# EAGLE schematic radio_V12.08.23 (EAGLE 5.01)
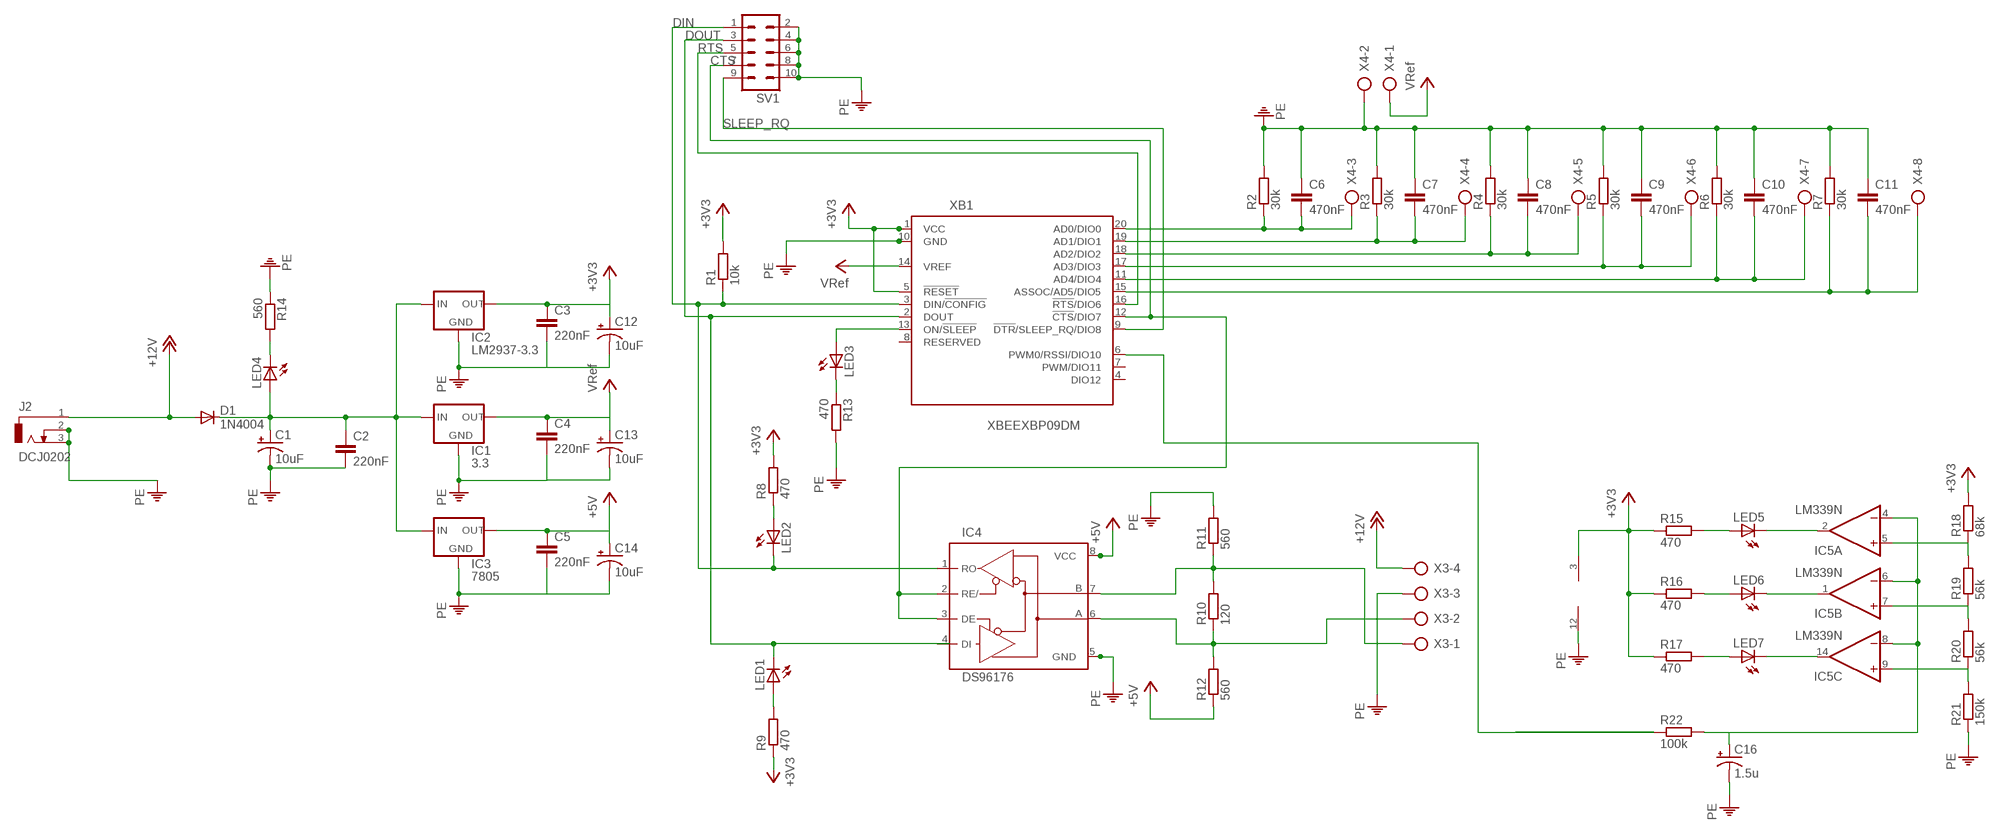
[diagram p0: schematic, sheet 1]

## Parts
C1  10uF  CPOL-USE2-5  [E2-5]
C2  220nF  C5/3.5  [C5B3.5]
C3  220nF  C5/3.5  [C5B3.5]
C4  220nF  C5/3.5  [C5B3.5]
C5  220nF  C5/3.5  [C5B3.5]
C6  470nF  C5/3.5  [C5B3.5]
C7  470nF  C5/3.5  [C5B3.5]
C8  470nF  C5/3.5  [C5B3.5]
C9  470nF  C5/3.5  [C5B3.5]
C10  470nF  C5/3.5  [C5B3.5]
C11  470nF  C5/3.5  [C5B3.5]
C12  10uF  CPOL-USE2-5  [E2-5]
C13  10uF  CPOL-USE2-5  [E2-5]
C14  10uF  CPOL-USE2-5  [E2-5]
C16  1.5u  CPOL-USE2-5  [E2-5]
D1  1N4004  [DO41-10]
IC1  3.3  78XXL  [78XXL]
IC2  LM2937-3.3  78XXL  [78XXL]
IC3  7805  78XXL  [78XXL]
IC4  DS96176  MAX3468CPA  [DIL08]
IC5  LM339N  [DIL14]
J2  DCJ0202  [DCJ0202]
LED1  LED3MM  [LED3MM]
LED2  LED3MM  [LED3MM]
LED3  LED3MM  [LED3MM]
LED4  LED5MM  [LED5MM]
LED5  LED3MM  [LED3MM]
LED6  LED3MM  [LED3MM]
LED7  LED3MM  [LED3MM]
R1  10k  R-EU_0207/7  [0207/7]
R2  30k  R-EU_0207/7  [0207/7]
R3  30k  R-EU_0207/7  [0207/7]
R4  30k  R-EU_0207/7  [0207/7]
R5  30k  R-EU_0207/7  [0207/7]
R6  30k  R-EU_0207/7  [0207/7]
R7  30k  R-EU_0207/7  [0207/7]
R8  470  R-EU_0207/7  [0207/7]
R9  470  R-EU_0207/7  [0207/7]
R10  120  R-EU_0207/7  [0207/7]
R11  560  R-EU_0207/7  [0207/7]
R12  560  R-EU_0207/7  [0207/7]
R13  470  R-EU_0207/7  [0207/7]
R14  560  R-EU_0207/7  [0207/7]
R15  470  R-EU_0207/7  [0207/7]
R16  470  R-EU_0207/7  [0207/7]
R17  470  R-EU_0207/7  [0207/7]
R18  68k  R-EU_0207/7  [0207/7]
R19  56k  R-EU_0207/7  [0207/7]
R20  56k  R-EU_0207/7  [0207/7]
R21  150k  R-EU_0207/7  [0207/7]
R22  100k  R-EU_0207/7  [0207/7]
SV1  ML10  [ML10]
X3  AK500/4-H  [AK500/4-H]
X4  AK500/8-H  [AK500/8-H]
XB1  XBEEXBP09DM  [XBEE-PRO]

## Nets
+3V3: C3.1 C12.+ IC2.OUT IC5.3(P:V+) R1.2 R8.2 R9.1 R15.1 R16.1 R17.1 R18.2 XB1.1(VCC) XB1.5(!RESET)
+5V: C5.1 C14.+ IC3.OUT IC4.8(VCC) R12.1
+12V: D1.A J2.1 X3.4
CTS: IC4.2(RE/) IC4.3(DE) SV1.7 XB1.12(!CTS!/DIO7)
DIN: IC4.1(RO) LED2.K(C) R1.1 SV1.1 XB1.3(DIN/!CONFIG)
DOUT: LED1.K(C) SV1.3 XB1.2(DOUT)
N$2: C1.+ C2.1 D1.C IC1.IN IC2.IN IC3.IN LED4.A
N$3: C6.2 R2.1 X4.3 XB1.20(AD0/DIO0)
N$4: C7.2 R3.1 X4.4 XB1.19(AD1/DIO1)
N$5: C8.2 R4.1 X4.5 XB1.18(AD2/DIO2)
N$6: C9.2 R5.1 X4.6 XB1.17(AD3/DIO3)
N$7: C10.2 R6.1 X4.7 XB1.11(AD4/DIO4)
N$8: C11.2 R7.1 X4.8 XB1.15(ASSOC/AD5/DIO5)
N$10: LED2.A R8.1
N$11: LED1.A R9.2
N$13: LED3.A XB1.13(ON/!SLEEP)
N$14: LED3.K(C) R13.1
N$15: LED4.K(C) R14.2
N$16: IC4.6(A) R10.1 R12.2 X3.2
N$17: IC4.7(B) R10.2 R11.1 X3.1
N$24: IC5.2(A:OUT) LED5.K(C)
N$25: IC5.1(B:OUT) LED6.K(C)
N$26: IC5.14(C:OUT) LED7.K(C)
N$27: LED7.A R17.2
N$28: LED6.A R16.2
N$29: LED5.A R15.2
N$30: IC5.5(A:+IN) R18.1 R19.2
N$31: IC5.7(B:+IN) R19.1 R20.2
N$32: IC5.9(C:+IN) R20.1 R21.2
N$33: C16.+ IC5.4(A:-IN) IC5.6(B:-IN) IC5.8(C:-IN) R22.2
N$36: R22.1 XB1.6(PWM0/RSSI/DIO10)
PE: C1.- C2.2 C3.2 C4.2 C5.2 C6.1 C7.1 C8.1 C9.1 C10.1 C11.1 C12.- C13.- C14.- C16.- IC1.GND IC2.GND IC3.GND IC4.5(GND) IC5.12(P:GND) J2.2 J2.3 R2.2 R3.2 R4.2 R5.2 R6.2 R7.2 R11.2 R13.2 R14.1 R21.1 SV1.2 SV1.4 SV1.6 SV1.8 SV1.10 X3.3 X4.2 XB1.10(GND)
RTS: SV1.5 XB1.16(!RTS!/DIO6)
SLEEP_RQ: SV1.9 XB1.9(!DTR!/SLEEP_RQ/DIO8)
VCC: C4.1 C13.+ IC1.OUT X4.1 XB1.14(VREF) ; supply symbol labelled VRef
Unconnected: IC4.4(DI) IC5.10(D:-IN) IC5.11(D:+IN) IC5.13(D:OUT) XB1.7(PWM/DIO11)

## Power pins joined to a net without a drawn wire
DIO12: XB1.4(DIO12)
RESERVED: XB1.8(RESERVED)

## Library data of the parts
C1 C12-C14 C16 = rcl:CPOL-US: POLARIZED CAPACITOR, American symbol
C2-C11 = capacitor-wima:C: CAPACITOR naming: grid - package width
D1 = diode:1N4004: DIODE general purpose rectifier, 1 A
IC1-IC3 = v-reg:78XXL: VOLTAGE REGULATOR
IC4 = maxim:MAX34*: +5V, Fail-Safe, 40Mbps, Profibus RS-485/RS-422 Transceivers Source: MAX3465-MAX3469.pdf
IC5 = linear:LM339: Low Power Low Offset Voltage Quad Comparators with open collector; LM139/LM239/LM339/LM2901/LM3302
J2 = con-jack:DCJ0202: DC POWER JACK Source: DCJ0202.pdf
LED1-LED7 = led:LED: LED OSRAM: - CHIPLED LG R971, LG N971, LY N971, LG Q971, LY Q971, LO R971, LY R971 LH N974, LH R974 LS Q976, LO Q976, LY Q976 LO Q996 - Hyper CHIPLED LW Q18S LB Q993, LB Q99A, LB R99A - SideLED LS A670, LO A670, LY A670, LG A670, LP A670 LB A673, LV A673, LT A673, LW A673 LH A674 LY A675 LS A676, LA A676, LO A676, LY A676, LW A676 LS A679, LY A679, LG A679 - Hyper Micro SIDELED® LS Y876, LA Y876, LO Y876, LY Y876 LT Y87S - SmartLED LW L88C, LW L88S LB L89C, LB L89S, LG L890 LS L89K, LO L89K, LY L89K LS L896, LA L896, LO L896, LY L896 - TOPLED LS T670, LO T670, LY T670, LG T670, LP T670 LSG T670, LSP T670, LSY T670, LOP T670, LYG T670 LG T671, LOG T671, LSG T671 LB T673, LV T673, LT T673, LW T673 LH T674 LS T676, LA T676, LO T676, LY T676, LB T676, LH T676, LSB T676, LW T676 LB T67C, LV T67C, LT T67C, LS T67K, LO T67K, LY T67K, LW E67C LS E67B, LA E67B, LO E67B, LY E67B, LB E67C, LV E67C, LT E67C LW T67C LS T679, LY T679, LG T679 LS T770, LO T770, LY T770, LG T770, LP T770 LB T773, LV T773, LT T773, LW T773 LH T774 LS E675, LA E675, LY E675, LS T675 LS T776, LA T776, LO T776, LY T776, LB T776 LHGB T686 LT T68C, LB T68C - Hyper Mini TOPLED® LB M676 - Mini TOPLED Santana® LG M470 LS M47K, LO M47K, LY M47K Source: http://www.osram.convergy.de - LUMILED® LXK2-PW12-R00, LXK2-PW12-S00, LXK2-PW14-U00, LXK2-PW14-V00 LXK2-PM12-R00, LXK2-PM12-S00, LXK2-PM14-U00 LXK2-PE12-Q00, LXK2-PE12-R00, LXK2-PE12-S00, LXK2-PE14-T00, LXK2-PE14-U00 LXK2-PB12-K00, LXK2-PB12-L00, LXK2-PB12-M00, LXK2-PB14-N00, LXK2-PB14-P00, LXK2-PB14-Q00 LXK2-PR12-L00, LXK2-PR12-M00, LXK2-PR14-Q00, LXK2-PR14-R00 LXK2-PD12-Q00, LXK2-PD12-R00, LXK2-PD12-S00 LXK2-PH12-R00, LXK2-PH12-S00 LXK2-PL12-P00, LXK2-PL12-Q00, LXK2-PL12-R00 Source: www.luxeon.com
R1-R22 = resistor:R-EU_: RESISTOR, European symbol
SV1 = con-harting-ml:ML10: HARTING
X3 = con-ptr500:AK500/4-H: CONNECTOR Aug. 2004 / PTR Meßtechnik: Die Bezeichnung der Serie AK505 wurde geändert. Es handelt sich hierbei um AK500 in horizontaler Ausführung.
X4 = con-ptr500:AK500/8-H: CONNECTOR Aug. 2004 / PTR Meßtechnik: Die Bezeichnung der Serie AK505 wurde geändert. Es handelt sich hierbei um AK500 in horizontaler Ausführung.
XB1 = maxstream3:XBEE: XBee (TM) /XBee-PRO(TM) OEM RF Modules Source: MaxStream, Inc. xbee_productmanual.pdf